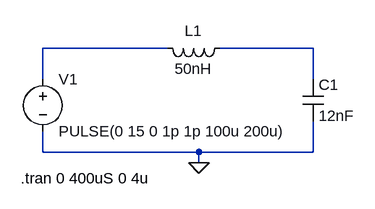
[diagram p0: schematic gatedrive_ideal.asc]
gatedrive_ideal.asc, the LTspice schematic file:
Version 4
SHEET 1 880 680
WIRE 272 96 80 96
WIRE 496 96 352 96
WIRE 80 144 80 96
WIRE 496 144 496 96
WIRE 80 256 80 224
WIRE 320 256 80 256
WIRE 496 256 496 208
WIRE 496 256 320 256
WIRE 320 272 320 256
FLAG 320 272 0
SYMBOL voltage 80 128 R0
WINDOW 123 0 0 Left 0
WINDOW 39 0 0 Left 0
SYMATTR InstName V1
SYMATTR Value PULSE(0 15 0 1p 1p 100u 200u)
SYMBOL cap 480 144 R0
SYMATTR InstName C1
SYMATTR Value 12nF
SYMBOL ind 368 80 R90
WINDOW 0 5 56 VBottom 2
WINDOW 3 32 56 VTop 2
SYMATTR InstName L1
SYMATTR Value 50nH
TEXT 46 296 Left 2 !.tran 0 400uS 0 4u

The netlist it stands for:
* gatedrive_ideal.asc
V1 N001 0 PULSE(0 15 0 1p 1p 100u 200u)
C1 N002 0 12nF
L1 N002 N001 50nH
.tran 0 400uS 0 4u
.backanno
.end